# Altium schematic sheet RGB LED.SchDoc
size A4; SheetNumber: 1; SheetTotal: 1
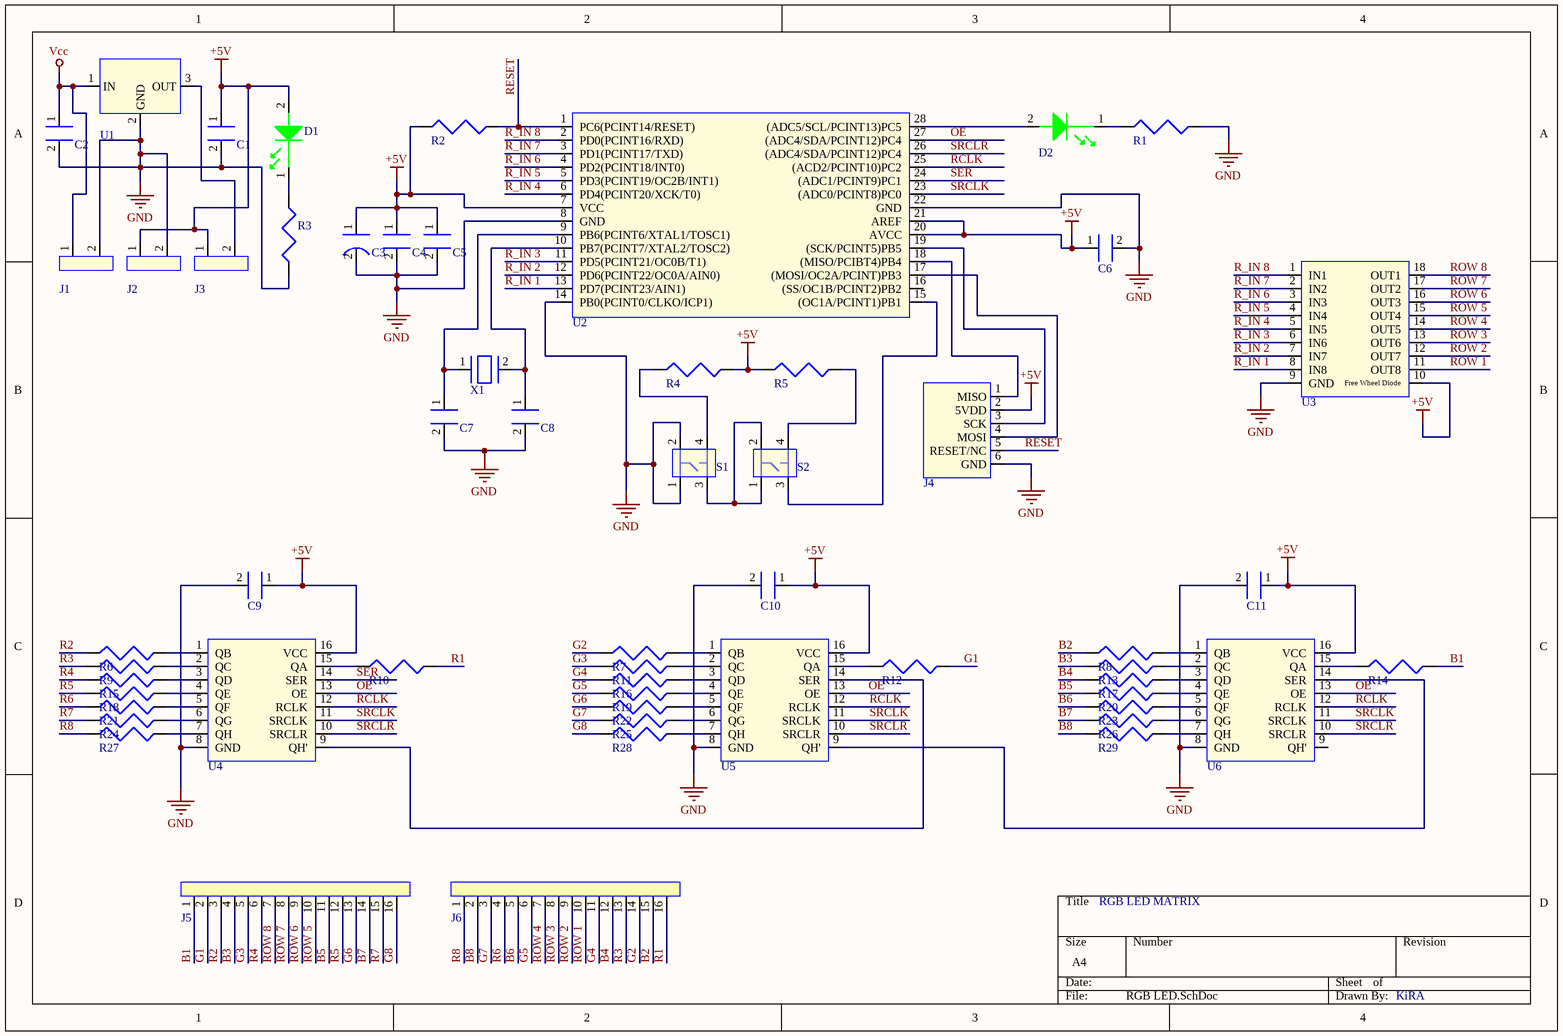
[diagram p0: RGB LED.SchDoc]

## Parts
C1  10uF  [Cap 10uF 0805]  (value not drawn)
C2  10uF  [Cap 10uF 0805]  (value not drawn)
C3  47uF  [cap 47uF radial can]  (value not drawn)
C4  10uF  [Cap 10uF 0805]  (value not drawn)
C5  0.1uF  [Cap 0.1uF 0805]  (value not drawn)
C6  0.1uF  [Cap 0.1uF 0805]  (value not drawn)
C7  22pF  [CAP 22pF 0805]  (value not drawn)
C8  22pF  [CAP 22pF 0805]  (value not drawn)
C9  0.1uF  [Cap 0.1uF 0805]  (value not drawn)
C10  0.1uF  [Cap 0.1uF 0805]  (value not drawn)
C11  0.1uF  [Cap 0.1uF 0805]  (value not drawn)
D1  LED 0805 Green  [LED 0805 Green]  (value not drawn)
D2  LED 0805 Green  [LED 0805 Green]  (value not drawn)
J1  Generic Header, 1X2 Vertical  [22232021]  (value not drawn)
J2  Generic Header, 1X2 Vertical  [22232021]  (value not drawn)
J3  Generic Header, 1X2 Vertical  [22232021]  (value not drawn)
J4  6-Pin ISP header  [2X3 ISP header]  (value not drawn)
J5  16pin felmale header  [16 pins female header]  (value not drawn)
J6  16pin felmale header  [16 pins female header]  (value not drawn)
R1  200R  [RES 200R 0805]  (value not drawn)
R2  10K  [RES 10K 0805]  (value not drawn)
R3  200R  [RES 200R 0805]  (value not drawn)
R4  10K  [RES 10K 0805]  (value not drawn)
R5  10K  [RES 10K 0805]  (value not drawn)
R6  Resistor 0805 100R  [RES 100R 0805]  (value not drawn)
R7  Resistor 0805 100R  [RES 100R 0805]  (value not drawn)
R8  Resistor 0805 100R  [RES 100R 0805]  (value not drawn)
R9  Resistor 0805 100R  [RES 100R 0805]  (value not drawn)
R10  Resistor 0805 100R  [RES 100R 0805]  (value not drawn)
R11  Resistor 0805 100R  [RES 100R 0805]  (value not drawn)
R12  Resistor 0805 100R  [RES 100R 0805]  (value not drawn)
R13  Resistor 0805 100R  [RES 100R 0805]  (value not drawn)
R14  Resistor 0805 100R  [RES 100R 0805]  (value not drawn)
R15  Resistor 0805 100R  [RES 100R 0805]  (value not drawn)
R16  Resistor 0805 100R  [RES 100R 0805]  (value not drawn)
R17  Resistor 0805 100R  [RES 100R 0805]  (value not drawn)
R18  Resistor 0805 100R  [RES 100R 0805]  (value not drawn)
R19  Resistor 0805 100R  [RES 100R 0805]  (value not drawn)
R20  Resistor 0805 100R  [RES 100R 0805]  (value not drawn)
R21  Resistor 0805 100R  [RES 100R 0805]  (value not drawn)
R22  Resistor 0805 100R  [RES 100R 0805]  (value not drawn)
R23  Resistor 0805 100R  [RES 100R 0805]  (value not drawn)
R24  Resistor 0805 100R  [RES 100R 0805]  (value not drawn)
R25  Resistor 0805 100R  [RES 100R 0805]  (value not drawn)
R26  Resistor 0805 100R  [RES 100R 0805]  (value not drawn)
R27  Resistor 0805 100R  [RES 100R 0805]  (value not drawn)
R28  Resistor 0805 100R  [RES 100R 0805]  (value not drawn)
R29  Resistor 0805 100R  [RES 100R 0805]  (value not drawn)
S1  Tactile Switch  [Tactile Switch]  (value not drawn)
S2  Tactile Switch  [Tactile Switch]  (value not drawn)
U1  L7805CV  [L7805VC]  (value not drawn)
U2  ATmega328P  [ATmega328P]  (value not drawn)
U3  ULN2803A  [ULN2803A]  (value not drawn)
U4  SN74HC595N  [SN74HC595N-SOP]  (value not drawn)
U5  SN74HC595N  [SN74HC595N-SOP]  (value not drawn)
U6  SN74HC595N  [SN74HC595N-SOP]  (value not drawn)
X1  Crystal 16MHz  [Crystal 16MHz]  (value not drawn)

## Nets
+5V: C1.1 C3.1 C4.1 C5.1 C6.1 C9.1 C10.1 C11.1 D1.2 J2.1(+) J3.1(+) J4.2(5VDD) R2.1 R4.2 R5.1 U2.7(VCC) U2.20(AVCC) U2.21(AREF) U3.10(Free_Wheel_Diode) U4.16(VCC) U5.16(VCC) U6.16(VCC)
GND: C1.2 C2.2 C3.2 C4.2 C5.2 C6.2 C7.2 C8.2 C9.2 C10.2 C11.2 J1.2(-) J2.2(-) J4.6(GND) R1.1 R3.1 S1.1 S1.2 U1.2(GND) U2.8(GND) U2.14(PB0(PCINT0/CLKO/ICP1)) U2.22(GND) U3.9(GND) U4.8(GND) U5.8(GND) U6.8(GND)
Vcc: C2.1 J1.1(+) U1.1(IN)
B1: J5.1 R14.2
B2: J6.15 R8.1
B3: J5.4 R13.1
B4: J6.12 R17.1
B5: J5.11 R20.1
B6: J6.5 R23.1
B7: J5.14 R26.1
B8: J6.2 R29.1
G1: J5.2 R12.2
G2: J6.14 R7.1
G3: J5.5 R11.1
G4: J6.11 R16.1
G5: J6.6 R19.1
G6: J5.13 R22.1
G7: J6.3 R25.1
G8: J5.16 R28.1
OE: U2.27((ADC4/SDA/PCINT12)PC4) U4.13(OE) U5.13(OE) U6.13(OE)
R1: J6.16 R10.2
R2: J5.3 R6.1
R3: J6.13 R9.1
R4: J5.6 R15.1
R5: J5.12 R18.1
R6: J6.4 R21.1
R7: J5.15 R24.1
R8: J6.1 R27.1
R_IN 1: U2.13(PD7(PCINT23/AIN1)) U3.8(IN8)
R_IN 2: U2.12(PD6(PCINT22/OC0A/AIN0)) U3.7(IN7)
R_IN 3: U2.11(PD5(PCINT21/OC0B/T1)) U3.6(IN6)
R_IN 4: U2.6(PD4(PCINT20/XCK/T0)) U3.5(IN5)
R_IN 5: U2.5(PD3(PCINT19/OC2B/INT1)) U3.4(IN4)
R_IN 6: U2.4(PD2(PCINT18/INT0)) U3.3(IN3)
R_IN 7: U2.3(PD1(PCINT17/TXD)) U3.2(IN2)
R_IN 8: U2.2(PD0(PCINT16/RXD)) U3.1(IN1)
RCLK: U2.25((ACD2/PCINT10)PC2) U4.12(RCLK) U5.12(RCLK) U6.12(RCLK)
RESET: J4.5(RESET/NC) R2.2 U2.1(PC6(PCINT14/RESET))
ROW 1: J6.10 U3.11(OUT8)
ROW 2: J6.9 U3.12(OUT7)
ROW 3: J6.8 U3.13(OUT6)
ROW 4: J6.7 U3.14(OUT5)
ROW 5: J5.10 U3.15(OUT4)
ROW 6: J5.9 U3.16(OUT3)
ROW 7: J5.8 U3.17(OUT2)
ROW 8: J5.7 U3.18(OUT1)
SER: U2.24((ADC1/PCINT9)PC1) U4.14(SER)
SRCLK: U2.23((ADC0/PCINT8)PC0) U4.11(SRCLK) U5.11(SRCLK) U6.11(SRCLK)
SRCLR: U2.26((ADC4/SDA/PCINT12)PC4) U4.10(SRCLR) U5.10(SRCLR) U6.10(SRCLR)
NetC7_1: C7.1 U2.9(PB6(PCINT6/XTAL1/TOSC1)) X1.1
NetC8_1: C8.1 U2.10(PB7(PCINT7/XTAL2/TOSC2)) X1.2
NetD1_1: D1.1 R3.2
NetD2_1: D2.1 R1.2
NetD2_2: D2.2 U2.28((ADC5/SCL/PCINT13)PC5)
NetJ3_2: J3.2(-) U1.3(OUT)
NetJ4_1: J4.1(MISO) U2.18((MISO/PCIBT4)PB4)
NetJ4_3: J4.3(SCK) U2.19((SCK/PCINT5)PB5)
NetJ4_4: J4.4(MOSI) U2.17((MOSI/OC2A/PCINT)PB3)
NetR4_1: R4.1 S1.4
NetR5_2: R5.2 S2.4
NetR6_2: R6.2 U4.1(QB)
NetR7_2: R7.2 U5.1(QB)
NetR8_2: R8.2 U6.1(QB)
NetR9_2: R9.2 U4.2(QC)
NetR10_1: R10.1 U4.15(QA)
NetR11_2: R11.2 U5.2(QC)
NetR12_1: R12.1 U5.15(QA)
NetR13_2: R13.2 U6.2(QC)
NetR14_1: R14.1 U6.15(QA)
NetR15_2: R15.2 U4.3(QD)
NetR16_2: R16.2 U5.3(QD)
NetR17_2: R17.2 U6.3(QD)
NetR18_2: R18.2 U4.4(QE)
NetR19_2: R19.2 U5.4(QE)
NetR20_2: R20.2 U6.4(QE)
NetR21_2: R21.2 U4.5(QF)
NetR22_2: R22.2 U5.5(QF)
NetR23_2: R23.2 U6.5(QF)
NetR24_2: R24.2 U4.6(QG)
NetR25_2: R25.2 U5.6(QG)
NetR26_2: R26.2 U6.6(QG)
NetR27_2: R27.2 U4.7(QH)
NetR28_2: R28.2 U5.7(QH)
NetR29_2: R29.2 U6.7(QH)
NetS1_3: S1.3 S2.1 S2.2
NetS2_3: S2.3 U2.15((OC1A/PCINT1)PB1)
NetU4_9: U4.9(QH') U5.14(SER)
NetU5_9: U5.9(QH') U6.14(SER)

Not connected (* = marked no-connect by the designer): U2 16((SS/OC1B/PCINT2)PB2); U6 9(QH')

## Notes on the sheet
- RGB LED MATRIX
- KiRA

## Library data of the parts
C1 C2 C4 = 10uF 0805: Capacitance: 10uF; Package: 0805
C3 = 47uF Radial, Can -SMD: Manufacturer: Panasonic Electronic Components; Manufacturer Product Number: EEE-FK1V470P; Tolerance: ±20%; Vtg rated: 35V; Impedance: 360 mOhms; Series: FK; Capacitance: 47uF; Package: Radial, Can - SMD
C5 C6 C9-C11 = 0.1uF 0805: Capacitance: 0.1uF; Package: 0805
C7 C8 = 22pF 0805: Capacitance: 22pF; Package: 0805
D1 D2 = LED 0805 Green: Manufacturer: Lite-On Inc; Part No: LTST-C171GKT; Forward Voltage Vf: 2.1V; Test Current: 20mA; Pacakage: 0805; Colour: Green
J1-J3 = 2 pin male header: Manufacturer: Molex; Series NO: 6373; Product Name: KK254; Current max per contact: 4A; Voltage max: 500V; Pitch: 2.54mm; Part No: 22232021; Product Category: PCB Headers and Receptacles; Component Type: PCB Header
J4 = 6-Pin ISP header: No of Pins: 6; No of rows: 2
J5 J6 = 16pin felmale header: Manufacturer: 4ucon technology inc; Product ID: Adafruit 598
R1 R3 = Resistor 0805 200R: Manufacturer: KOA Speer Electronics Inc; Part No: RK73B2A; Power: 1/4W; Tolarance: ±5%; Resistance: 200R; Package: 0805
R2 R4 R5 = Resistor 0805 10K: Manufacturer: KOA Speer Electronics Inc; Part No: RK73B2A; Power: 1/4W; Tolarance: ±5%; Resistance: 10K; Package: 0805
R6-R29 = Resistor 0805 100R: Manufacturer: KOA Speer Electronics Inc; Part No: RK73B2A; Power: 1/4W; Tolarance: ±5%; Resistance: 100R; Package: 0805
S1 S2 = Tactile Switch: Plunger Type: Flat; Type: Standard B3F 1000 series
U1 = L7805CV: Manufacturer: STMicroelectronics; Vtg input (max): 35V; Vtg output (min/fixed): 5V; Current - Output: 1.5A; Part No: L7805CV; Mounting Type: SMD; Package: D2PAK
U2 = ATmega328P: Manufacturer: Microchip Technology; Core Processor: AVR; Core Size: 8-bit; Number of I/O pins: 23; Series: AVR ATmega; Number of pins: 28; Package: 28-DIP
U3 = ULN2803A: 8-Darlington Arrays; Manufacturer: STMicroelectronics; Part No: ULN2803A; Mounting Type: Through Hole; Package: 18-DIP
U4-U6 = SN74HC595N: Shift Register; Manufacturer: Texas Instrument; Output type: Tri-state; Function: Serial to Parallel, Serial; Vtg Supply: 2V ~ 6V; Part No: SN74HC595N; Series: 74HC; Logic Type: Shift Register; Mounting Type: Through Hole; Package: 16-DIP
X1 = Crystal 16MHz: Manufacturer: Abracon LLC; Part No: ABL-16.000MHZ-B2; Frequency: 16MHz; Package: HC-49/US